# EAGLE design V0.1 (EAGLE 9.3.0)
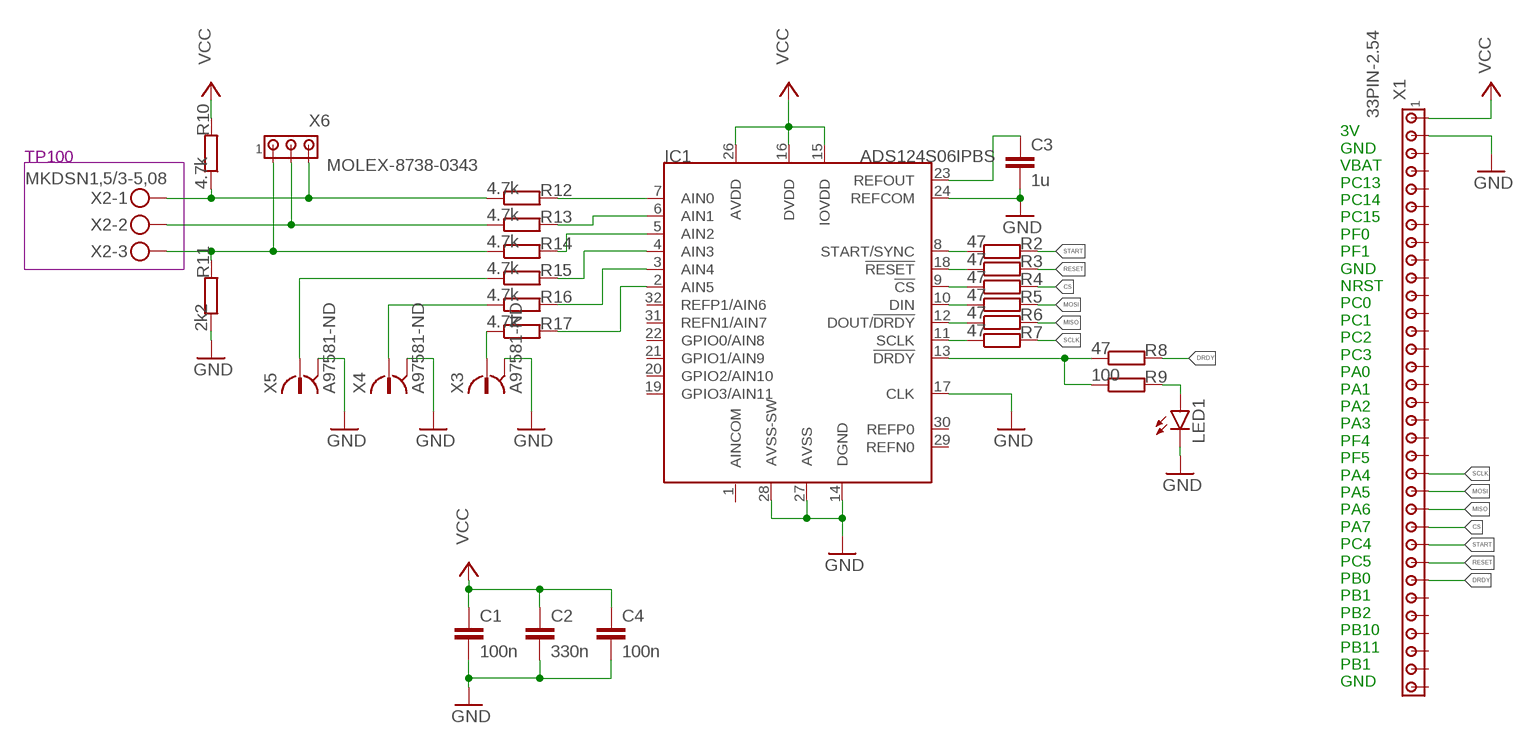
[diagram p0: schematic, sheet 1]

## Parts
C1  100n  C-EUC0603  [C0603]
C2  330n  C-EUC0603  [C0603]
C3  1u  C-EUC0603  [C0603]
C4  100n  C-EUC0603  [C0603]
IC1  ADS124S06IPBS  ADS124S0XIPBS  [TQFP32-05]
LED1  LEDSML0603  [SML0603]
R2  47  R-EU_R0603  [R0603]
R3  47  R-EU_R0603  [R0603]
R4  47  R-EU_R0603  [R0603]
R5  47  R-EU_R0603  [R0603]
R6  47  R-EU_R0603  [R0603]
R7  47  R-EU_R0603  [R0603]
R8  47  R-EU_R0603  [R0603]
R9  100  R-EU_R0603  [R0603]
R10  4.7k  R-EU_R0603  [R0603]
R11  2k2  R-EU_R0805W  [R0805W]
R12  4.7k  R-EU_R0603  [R0603]
R13  4.7k  R-EU_R0603  [R0603]
R14  4.7k  R-EU_R0603  [R0603]
R15  4.7k  R-EU_R0603  [R0603]
R16  4.7k  R-EU_R0603  [R0603]
R17  4.7k  R-EU_R0603  [R0603]
X1  33PIN-2.54  [1X33]
X2  MKDSN1,5/3-5,08  [MKDSN1,5/3-5,08]
X3  A97581-ND  [1634503]
X4  A97581-ND  [1634503]
X5  A97581-ND  [1634503]
X6  MOLEX-8738-0343  [MOLEX-87438-0343]

## Nets
CS: R4.2 X1.24
DRDY: R8.2 X1.27
GND: C1.2 C2.2 C3.2 C4.2 IC1.14(DGND) IC1.17(CLK) IC1.24(REFCOM) IC1.27(AVSS) IC1.28(AVSS-SW) LED1.C R11.1 X1.2 X3.2 X3.3 X3.4 X3.5 X4.2 X4.3 X4.4 X4.5 X5.2 X5.3 X5.4 X5.5
MISO: R6.2 X1.23
MOSI: R5.2 X1.22
N$1: IC1.8(START/SYNC) R2.1
N$2: IC1.18(!RESET) R3.1
N$3: IC1.9(!CS) R4.1
N$4: IC1.10(DIN) R5.1
N$5: IC1.12(DOUT/!DRDY) R6.1
N$6: IC1.11(SCLK) R7.1
N$7: IC1.13(!DRDY) R8.1 R9.1
N$8: R10.1 R12.1 X2.1 X6.3 X6.3_1
N$9: R13.1 X2.2 X6.2 X6.2_1
N$10: R11.2 R14.1 X2.3 X6.1 X6.1_1
N$11: R15.1 X5.1
N$12: IC1.3(AIN4) R16.2
N$13: IC1.2(AIN5) R17.2
N$14: LED1.A R9.2
N$15: C3.1 IC1.23(REFOUT)
N$16: IC1.4(AIN3) R15.2
N$17: R16.1 X4.1
N$18: R17.1 X3.1
N$19: IC1.5(AIN2) R14.2
N$20: IC1.7(AIN0) R12.2
N$21: IC1.6(AIN1) R13.2
RESET: R3.2 X1.26
SCLK: R7.2 X1.21
START: R2.2 X1.25
VCC: C1.1 C2.1 C4.1 IC1.15(IOVDD) IC1.16(DVDD) IC1.26(AVDD) R10.2 X1.1
Unconnected: IC1.1(AINCOM) IC1.19(GPIO3/AIN11) IC1.20(GPIO2/AIN10) IC1.21(GPIO1/AIN9) IC1.22(GPIO0/AIN8) IC1.29(REFN0) IC1.30(REFP0) IC1.31(REFN1/AIN7) IC1.32(REFP1/AIN6) X1.3 X1.4 X1.5 X1.6 X1.7 X1.8 X1.9 X1.10 X1.11 X1.12 X1.13 X1.14 X1.15 X1.16 X1.17 X1.18 X1.19 X1.20 X1.28 X1.29 X1.30 X1.31 X1.32 X1.33

## Notes on the sheet
- TP100
- 3V
  GND
  VBAT
  PC13
  PC14
  PC15
  PF0
  PF1
  GND
  NRST
  PC0
  PC1
  PC2
  PC3
  PA0
  PA1
  PA2
  PA3
  PF4
  PF5
  PA4
  PA5
  PA6
  PA7
  PC4
  PC5
  PB0
  PB1
  PB2
  PB10
  PB11
  PB1
  GND

## Library data of the parts
C1 C4 = rcl:C-EU: CAPACITOR, European symbol; DIGIKEY_NR: 1276-6439-1-ND; DIGIKEY_PRICE: 0.10; SPICEPREFIX: C
C2 = rcl:C-EU: CAPACITOR, European symbol; DIGIKEY_NR: 490-6050-1-ND; DIGIKEY_PRICE: 0.22; SPICEPREFIX: C
C3 = rcl:C-EU: CAPACITOR, European symbol; DIGIKEY_NR: 1276-1182-1-ND; DIGIKEY_PRICE: 0.10; SPICEPREFIX: C
IC1 = ADC-Erweiterung:ADS124S0X; DIGIKEY_NR: 296-45188-ND; DIGIKEY_PRICE: 10.15
LED1 = led:LED: LED OSRAM: - CHIPLED LG R971, LG N971, LY N971, LG Q971, LY Q971, LO R971, LY R971 LH N974, LH R974 LS Q976, LO Q976, LY Q976 LO Q996 - Hyper CHIPLED LW Q18S LB Q993, LB Q99A, LB R99A - SideLED LS A670, LO A670, LY A670, LG A670, LP A670 LB A673, LV A673, LT A673, LW A673 LH A674 LY A675 LS A676, LA A676, LO A676, LY A676, LW A676 LS A679, LY A679, LG A679 - Hyper Micro SIDELED® LS Y876, LA Y876, LO Y876, LY Y876 LT Y87S - SmartLED LW L88C, LW L88S LB L89C, LB L89S, LG L890 LS L89K, LO L89K, LY L89K LS L896, LA L896, LO L896, LY L896 - TOPLED LS T670, LO T670, LY T670, LG T670, LP T670 LSG T670, LSP T670, LSY T670, LOP T670, LYG T670 LG T671, LOG T671, LSG T671 LB T673, LV T673, LT T673, LW T673 LH T674 LS T676, LA T676, LO T676, LY T676, LB T676, LH T676, LSB T676, LW T676 LB T67C, LV T67C, LT T67C, LS T67K, LO T67K, LY T67K, LW E67C LS E67B, LA E67B, LO E67B, LY E67B, LB E67C, LV E67C, LT E67C LW T67C LS T679, LY T679, LG T679 LS T770, LO T770, LY T770, LG T770, LP T770 LB T773, LV T773, LT T773, LW T773 LH T774 LS E675, LA E675, LY E675, LS T675 LS T776, LA T776, LO T776, LY T776, LB T776 LHGB T686 LT T68C, LB T68C - Hyper Mini TOPLED® LB M676 - Mini TOPLED Santana® LG M470 LS M47K, LO M47K, LY M47K Source: http://www.osram.convergy.de LUXEON: - LUMILED® LXK2-PW12-R00, LXK2-PW12-S00, LXK2-PW14-U00, LXK2-PW14-V00 LXK2-PM12-R00, LXK2-PM12-S00, LXK2-PM14-U00 LXK2-PE12-Q00, LXK2-PE12-R00, LXK2-PE12-S00, LXK2-PE14-T00, LXK2-PE14-U00 LXK2-PB12-K00, LXK2-PB12-L00, LXK2-PB12-M00, LXK2-PB14-N00, LXK2-PB14-P00, LXK2-PB14-Q00 LXK2-PR12-L00, LXK2-PR12-M00, LXK2-PR14-Q00, LXK2-PR14-R00 LXK2-PD12-Q00, LXK2-PD12-R00, LXK2-PD12-S00 LXK2-PH12-R00, LXK2-PH12-S00 LXK2-PL12-P00, LXK2-PL12-Q00, LXK2-PL12-R00 Source: www.luxeon.com KINGBRIGHT: KA-3528ASYC Source: www.kingbright.com; DIGIKEY_NR: 475-3118-1-ND; DIGIKEY_PRICE: 0.52
R2-R8 = rcl:R-EU_: RESISTOR, European symbol; DIGIKEY_NR: 311-470GRCT-ND; DIGIKEY_PRICE: 0.10; SPICEPREFIX: R
R9 = rcl:R-EU_: RESISTOR, European symbol; DIGIKEY_NR: 311-100DCT-ND; DIGIKEY_PRICE: 0.20; SPICEPREFIX: R
R10 R12-R17 = rcl:R-EU_: RESISTOR, European symbol; DIGIKEY_NR: 311-4.70KHRCT-ND; DIGIKEY_PRICE: 0.10; SPICEPREFIX: R
R11 = rcl:R-EU_: RESISTOR, European symbol; DIGIKEY_NR: 408-1635-1-ND; DIGIKEY_PRICE: 4.37; SPICEPREFIX: R
X1 = ADC-Erweiterung:33PIN-2.54; DIGIKEY_NR: 609-2223-ND; DIGIKEY_PRICE: 1.41
X2 = ADC-Erweiterung:MKDSN1,5/3-5,08: MKDSN 1,5/ 3-5,08 Printklemme Nennstrom: 13,5 A Nennspannung: 250 V Rastermaß: 5,08 mm Polzahl: 3 Anschlussart: Schraubanschluss Montage: Löten Anschlussrichtung Leiter/Platine: 0 ° Artikelnummer: 1729131 Source: http://eshop.phoenixcontact.com .. 1729131.pdf; DIGIKEY_NR: 277-14503-ND; DIGIKEY_PRICE: 1.57
X3-X5 = ADC-Erweiterung:A97581-ND; DIGIKEY_NR: A97581-ND; DIGIKEY_PRICE: 1.73
X6 = ADC-Erweiterung:MOLEX-8738-0343; DIGIKEY_NR: WM7647CT-ND; DIGIKEY_PRICE: 0.81

## Board
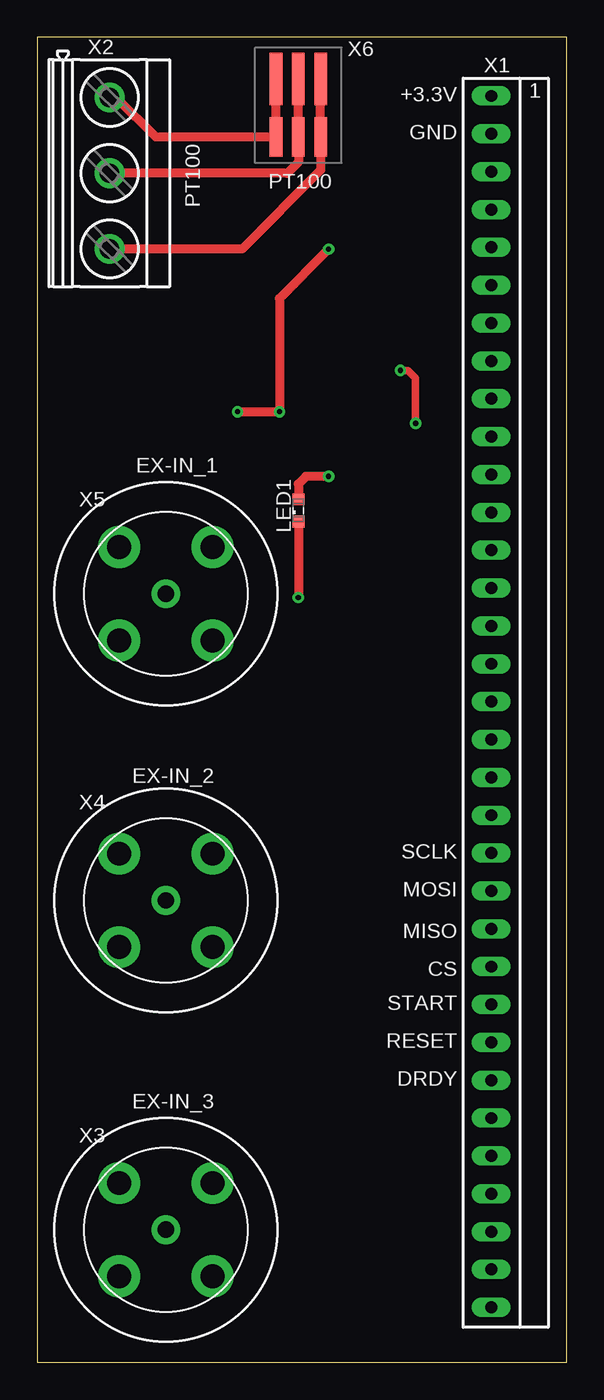
[diagram p1: board, top side]
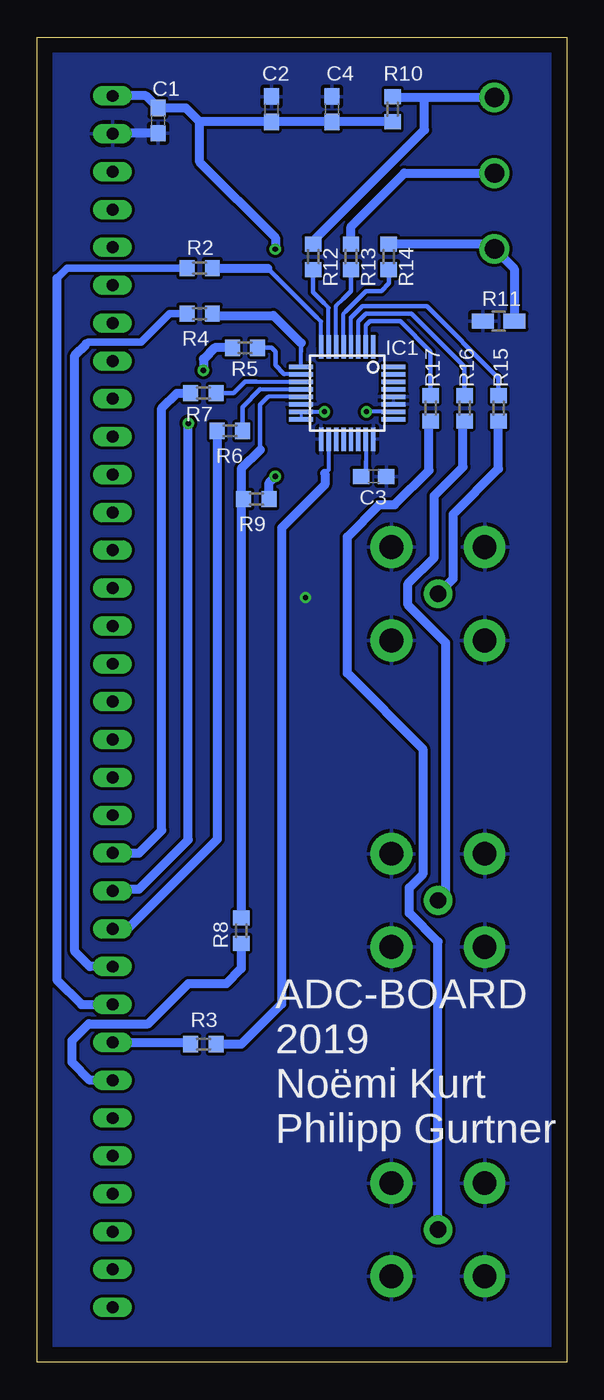
[diagram p2: board, bottom side, seen from below]

Size 35.54 x 88.9 mm. Coordinates in mm from the lower left corner, seen from the top.
Outline: 0,0 35.54,0 35.54,88.9 0,88.9 0,0
Copper layers (1*16): Top 0.035mm / dielectric 1.5mm / Bottom 0.035mm
Design rules "default *": minimum track width 6mil, minimum drill 0.35mm, track to track 0.2mm, track to pad 0.2mm, pad to pad 0.2mm, via to via 0.2mm, smd to smd 6mil, copper to edge 40mil, drill to drill 6mil, minimum pad ring 10mil, minimum via ring 8mil, stop-mask expansion 4mil, vias tented up to drill 0mil, thermal gap 10mil

### Footprints (pad centres in the part's own frame; a part is rotated, then mirrored left to right if it is on the bottom)
C0603 = smd 1.1 x 1: 1 -0.85,0; 2 0.85,0
TQFP32-05 = smd 1.6 x 0.3: 1 -3.1,1.75; 2 -3.1,1.25; 3 -3.1,0.75; 4 -3.1,0.25; 5 -3.1,-0.25; 6 -3.1,-0.75; 7 -3.1,-1.25; 8 -3.1,-1.75; 17 3.1,-1.75; 18 3.1,-1.25; 19 3.1,-0.75; 20 3.1,-0.25; 21 3.1,0.25; 22 3.1,0.75; 23 3.1,1.25; 24 3.1,1.75 | smd 0.3 x 1.6: 9 -1.75,-3.1; 10 -1.25,-3.1; 11 -0.75,-3.1; 12 -0.25,-3.1; 13 0.25,-3.1; 14 0.75,-3.1; 15 1.25,-3.1; 16 1.75,-3.1; 25 1.75,3.1; 26 1.25,3.1; 27 0.75,3.1; 28 0.25,3.1; 29 -0.25,3.1; 30 -0.75,3.1; 31 -1.25,3.1; 32 -1.75,3.1
SML0603 = smd 0.8 x 0.8: A 0.75,0; C -0.75,0
R0603 = smd 1 x 1.1: 1 -0.85,0; 2 0.85,0
R0805W = smd 1.5 x 1: 1 -1.052,0; 2 1.052,0
1X33 = drill 0.8 long: 1 -39.497,0; 2 -36.957,0; 3 -34.417,0; 4 -31.877,0; 5 -29.337,0; 6 -26.797,0; 7 -24.257,0; 8 -21.717,0; 9 -19.177,0; 10 -16.637,0; 11 -14.097,0; 12 -11.557,0; 13 -9.017,0; 14 -6.477,0; 15 -3.937,0; 16 -1.397,0; 17 1.143,0; 18 3.683,0; 19 6.223,0; 20 8.763,0; 21 11.303,0; 22 13.843,0; 23 16.383,0; 24 18.923,0; 25 21.463,0; 26 24.003,0; 27 26.543,0; 28 29.083,0; 29 31.623,0; 30 34.163,0; 31 36.703,0; 32 39.243,0; 33 41.783,0
MKDSN1,5/3-5,08 = drill 1.3 pad 2: 1 -7.641,0.025; 2 -2.561,0.025; 3 2.519,0.025
1634503 = drill 1.1 pad 1.93: 1 0,0 | drill 1.6 pad 2.8: 2 3.13,3.13; 3 3.13,-3.13; 4 -3.13,-3.13; 5 -3.13,3.13
MOLEX-87438-0343 = smd 3.55 x 0.85: 1 -1.775,1.5; 2 -1.775,0; 3 -1.775,-1.5 | smd 2.65 x 0.85: 1_1 2.125,1.5; 2_1 2.125,0; 3_1 2.125,-1.5

### Placement (x,y rotation side)
C1  27.43,83.31 270 bottom
C2  19.81,84.07 90 bottom
C3  12.95,59.44 0 bottom
C4  15.75,84.07 90 bottom
IC1  14.73,65.02 270 bottom
LED1  17.53,57.15 90 top
R2  24.64,73.41 180 bottom
R3  24.38,21.34 180 bottom
R4  24.64,70.36 180 bottom
R5  21.59,68.07 180 bottom
R6  22.61,62.48 180 bottom
R7  24.38,65.02 180 bottom
R8  21.84,28.96 270 bottom
R9  20.83,57.91 0 bottom
R10  11.68,84.07 270 bottom
R11  4.57,69.85 0 bottom
R12  17.02,74.17 270 bottom
R13  14.48,74.17 270 bottom
R14  11.94,74.17 270 bottom
R15  4.57,64.01 90 bottom
R16  6.86,64.01 90 bottom
R17  9.14,64.01 90 bottom
X1  30.48,45.47 270 top
X2  4.83,77.22 270 top
X3  8.64,8.89 0 top
X4  8.64,30.99 0 top
X5  8.64,51.56 0 top
X6  17.53,84.33 270 top

### Tracks (layer width: path | path; a pad name or v marks a point on that pad's centre or on a via)
CS
  Bottom 0.508: 32.26,68.33 32.13,68.45 28.57,68.45 26.67,70.36 R4.2
  Bottom 0.61: 32.26,68.33 33.02,67.56 33.02,27.56 32,26.54 X1.24
DRDY
  Bottom 0.61: 21.88,28.07 R8.2 21.84,26.42 22.86,25.4 25.4,25.4 28.08,22.72 32.08,22.72 33.21,21.59 33.21,20.13 32,18.92 X1.27
GND  (via drill 0.35)
  Top 0.61: LED1.C v17.53,51.31
  Bottom 0.61: C1.2 30.44,82.46 X1.2
  pour Bottom: -6.35,1.52 -0.51,-4.32 35.05,-4.32 37.85,-1.52 37.85,92.71 36.83,93.73 -1.27,93.73 -5.84,89.15 -6.35,89.15
MISO
  Bottom 0.61: R6.2 23.46,35.09 29.46,29.08 X1.23
MOSI  (via drill 0.35)
  Top 0.508: v25.4,62.99 25.4,66.04 24.89,66.55 v24.38,66.55
  Bottom 0.61: X1.22 30.35,31.75 28.7,31.75 25.4,35.05 v25.4,62.99 | R5.2 23.62,68.07 24.38,67.31 v24.38,66.55
N$1
  Bottom 0.254: IC1.8 16.48,69.82 16.76,70.1
  Bottom 0.305: 16.76,70.1 20.07,73.41
  Bottom 0.61: R2.1 20.07,73.41
N$2
  Bottom 0.254: IC1.18 15.98,59.89 16.24,59.64
  Bottom 0.61: 16.24,59.64 16.24,58.88 19.14,55.97 19.14,24.04 21.84,21.34 R3.1
N$3
  Bottom 0.254: IC1.9 17.83,67.82
  Bottom 0.305: 17.83,67.82 17.83,68.38
  Bottom 0.61: R4.1 23.66,70.23 19.68,70.23 17.83,68.38
N$4
  Bottom 0.254: IC1.10 17.85,66.29 18.96,66.29
  Bottom 0.305: R5.1 19.81,68.07 19.56,67.82 19.56,66.89 18.96,66.29
N$5
  Bottom 0.254: IC1.12 20.57,65.27 20.57,65.28
  Bottom 0.305: 20.57,65.28 21.76,64.1 R6.1
N$6
  Bottom 0.254: IC1.11 20.82,65.77 20.83,65.79
  Bottom 0.305: 20.83,65.79 21.59,65.79 22.35,65.02 R7.1
N$7
  Bottom 0.254: IC1.13 20.06,64.77 20.07,64.77
  Bottom 0.305: 20.07,64.77 20.57,64.26 20.57,61.21
  Bottom 0.61: 21.84,58.17 21.84,59.94 20.57,61.21 | 21.84,58.17 R8.1 | R9.1 21.84,58.08 21.84,58.17
N$8
  Top 0.61: X6.3 X6.3_1 7.97,82.2 5.31,84.86 X2.1
  Bottom 0.61: X2.1 7.37,84.86 9.65,84.86 | 9.65,84.86 11.62,84.86 R10.1 | R12.1 17.02,75.2 9.54,82.69 9.54,84.74 9.65,84.86
N$9
  Top 0.61: X6.2 X6.2_1 17.53,80.52 16.79,79.78 X2.2
  Bottom 0.61: R13.1 14.48,76.21 10.9,79.78 X2.2
N$10
  Top 0.61: X6.1 X6.1_1 19.03,79.99 13.74,74.7 X2.3
  Bottom 0.61: R11.2 3.52,73.37 X2.3 5.17,75.02 R14.1
N$11
  Bottom 0.61: X5.1 7.62,52.58 7.62,56.9 4.57,59.94 R15.1
N$12
  Bottom 0.254: IC1.3 13.97,68.14 13.97,69.85
  Bottom 0.305: 13.97,69.85 13.46,70.36 10.41,70.36 6.86,66.8 R16.2
N$13
  Bottom 0.254: IC1.2 13.48,69.58
  Bottom 0.305: 13.48,69.58 13.21,69.85 11.18,69.85 9.14,67.82 R17.2
N$14  (via drill 0.35)
  Top 0.61: 17.54,57.91 LED1.A 17.53,58.93 18.03,59.44 v19.56,59.44
  Bottom 0.61: R9.2 19.98,59.02 v19.56,59.44
N$15
  Bottom 0.254: IC1.23 13.48,60.45
  Bottom 0.305: 13.48,60.45 13.48,59.76 C3.1
N$16
  Bottom 0.254: IC1.4 14.48,70.1
  Bottom 0.305: R15.2 4.57,66.04 9.4,70.87 13.72,70.87 14.48,70.1
N$17
  Bottom 0.61: R16.1 6.96,63.06 6.96,60.08 8.89,58.15 8.89,54 10.66,52.23 10.66,50.81 8.13,48.28 8.13,31.5 X4.1
N$18
  Bottom 0.305: 9.23,63.08 R17.1
  Bottom 0.61: X3.1 8.64,28.21 10.57,30.14 10.57,31.83 9.65,32.74 9.65,41.16 14.73,46.23 14.73,55.37 12.57,57.53 11.55,57.53 9.25,59.84 9.25,63.06 9.23,63.08
N$19
  Bottom 0.254: IC1.5 14.98,70.36 14.86,70.48
  Bottom 0.305: 14.86,70.48 13.46,71.88 12.45,71.88 11.94,72.39 R14.2
N$20
  Bottom 0.254: IC1.7 15.98,70.76 16.3,71.08
  Bottom 0.305: R12.2 17.02,71.79 16.3,71.08
N$21
  Bottom 0.254: 14.99,71.37 15.48,70.88 IC1.6
  Bottom 0.305: R13.2 14.48,71.88 14.99,71.37
RESET
  Bottom 0.61: X1.26 25.36,21.46 R3.2
SCLK
  Bottom 0.61: X1.21 28.7,34.16 27.18,35.69 27.18,64.01 26.16,65.02 R7.2
START
  Bottom 0.508: R2.2 33.53,73.41 34.22,72.72
  Bottom 0.61: 34.22,72.72 34.22,25.65 32.57,24 X1.25
VCC  (via drill 0.35)
  Top 0.61: v19.56,74.68 16.26,71.37 v16.26,63.77 v13.44,63.77
  Bottom 0.2: IC1.15 IC1.16
  Bottom 0.254: IC1.26 v13.44,63.77 | IC1.15 v16.26,63.77
  Bottom 0.61: R10.2 C4.1 C2.1 24.64,83.22 | X1.1 28.23,84.96 C1.1 25.58,84.16 24.64,83.22 | 24.64,83.22 24.64,80.52 19.56,75.44 v19.56,74.68

### Text on the board
tNames: +3.3V | 1 | GND | PT100 | PT100 | EX-IN_1 | EX-IN_2 | SCLK | MOSI | MISO | CS | START | RESET | DRDY | EX-IN_3
bNames: ADC-BOARD / 2019 / Noëmi Kurt / Philipp Gurtner
tDocu: 1